# Altium schematic sheet IN_Connectors.SchDoc
size A4; SheetNumber: 5; SheetTotal: 13
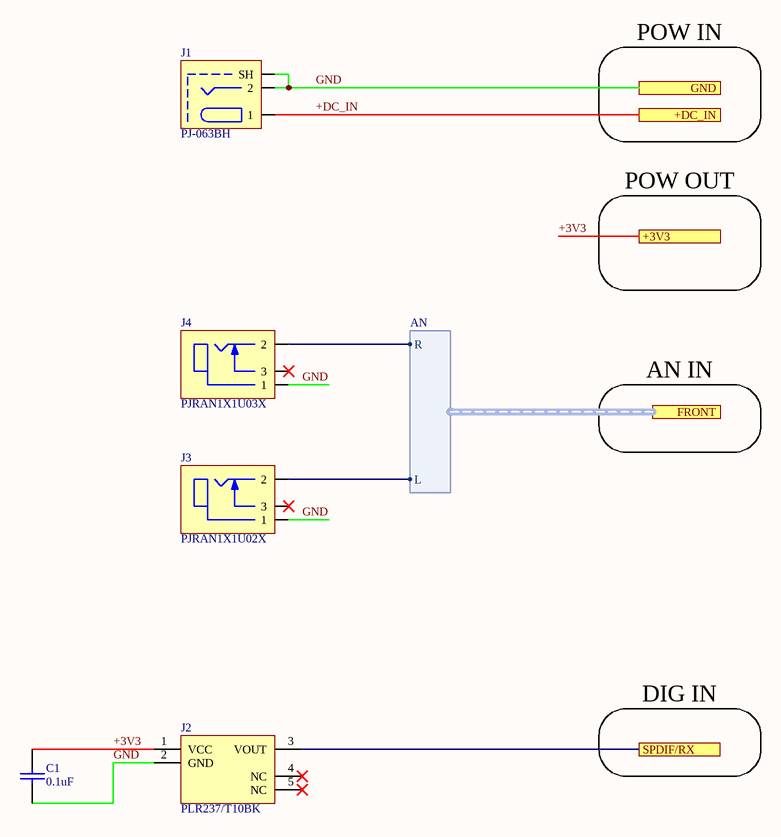
[diagram p0: IN_Connectors.SchDoc]

## Parts
C1  0.1uF  [0402-CAP-TDK]
J1  PJ-063BH  [PJ-063BH]
J2  PLR237/T10BK  [PLR237/T10BK]
J3  PJRAN1X1U02X  [RCA1X1-RA - SW]
J4  PJRAN1X1U03X  [RCA1X1-RA - SW]

## Ports
+3V3 (see AudioDSP-v3.0.0c_top[3A], ADC_Block[1A], ADC_Interface[1B], CTRL_Connectors[1A], DAC_Block[1B], DSP_Block[1A], MCU_Block[1A], OUT_Connectors[3B], PLL_Block[1A], POW_Block[4B]), +DC_IN (see AudioDSP-v3.0.0c_top[3A], POW_Block[1B]), FRONT (harness AN, see AudioDSP-v3.0.0c_top[3B]), GND (see AudioDSP-v3.0.0c_top[3A], ADC_Block[1B], ADC_Interface[1B], CTRL_Connectors[1A], DAC_Block[1B], DSP_Block[1A], LPF_Block[1B], LPF_Interface[1B], MCU_Block[1B], OUT_Connectors[3B], PLL_Block[1A], POW_Block[1B]), SPDIF/RX (see AudioDSP-v3.0.0c_top[3B], DSP_Block[1B])

## Harnesses
AN: L, R

## Nets
+3V3: C1.2 J2.1(VCC) ; port +3V3
+DC_IN: J1.1 ; port +DC_IN
GND: C1.1 J1.2 J1.3(SH) J2.2(GND) J3.1 J4.1 ; port GND
SPDIF/RX: J2.3(VOUT) ; port SPDIF/RX
NetJ3_2: J3.2 ; port FRONT.L
NetJ4_2: J4.2 ; port FRONT.R

Not connected (* = marked no-connect by the designer): J2 4(NC)* 5(NC)*; J3 3*; J4 3*

## Notes on the sheet
- POW IN
- POW OUT
- AN IN
- DIG IN

## Library data of the parts
C1 = CAP-SMD: JLCPart: C307331
J1 = PJ-063BH: CONN POWER JACK 2.5X5.5MM RA; Digikey_PN: CP-063BH-ND
J3 = PJRAN1X1U02X: CONN RCA JACK MONO 3.2MM R/A WHITE; Digikey_PN: PJRAN1X1U02X-ND
J4 = PJRAN1X1U03X: CONN RCA JACK MONO 3.2MM R/A RED; Digikey_PN: PJRAN1X1U03X-ND
J2 = PLR237/T10BK: Digikey_PN: 1080-PLR237/T10BK-ND